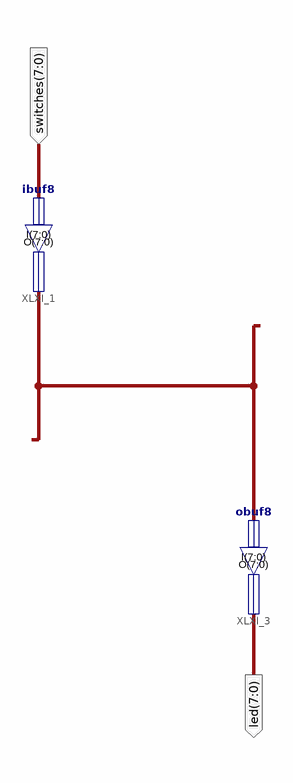
[diagram p0: schematic sheet 1]
// Xilinx ISE schematic toplevel.sch (spartan6) as structural Verilog: 2 symbols, 2 ports
module toplevel (
  input  [7:0] switches,
  output [7:0] led
);

  wire [7:0] XLXN_1;

  ibuf8 XLXI_1 (.I(switches), .O(XLXN_1));
  obuf8 XLXI_3 (.I(XLXN_1), .O(led));
endmodule
